# EAGLE design ir-splitter (EAGLE 6.3)
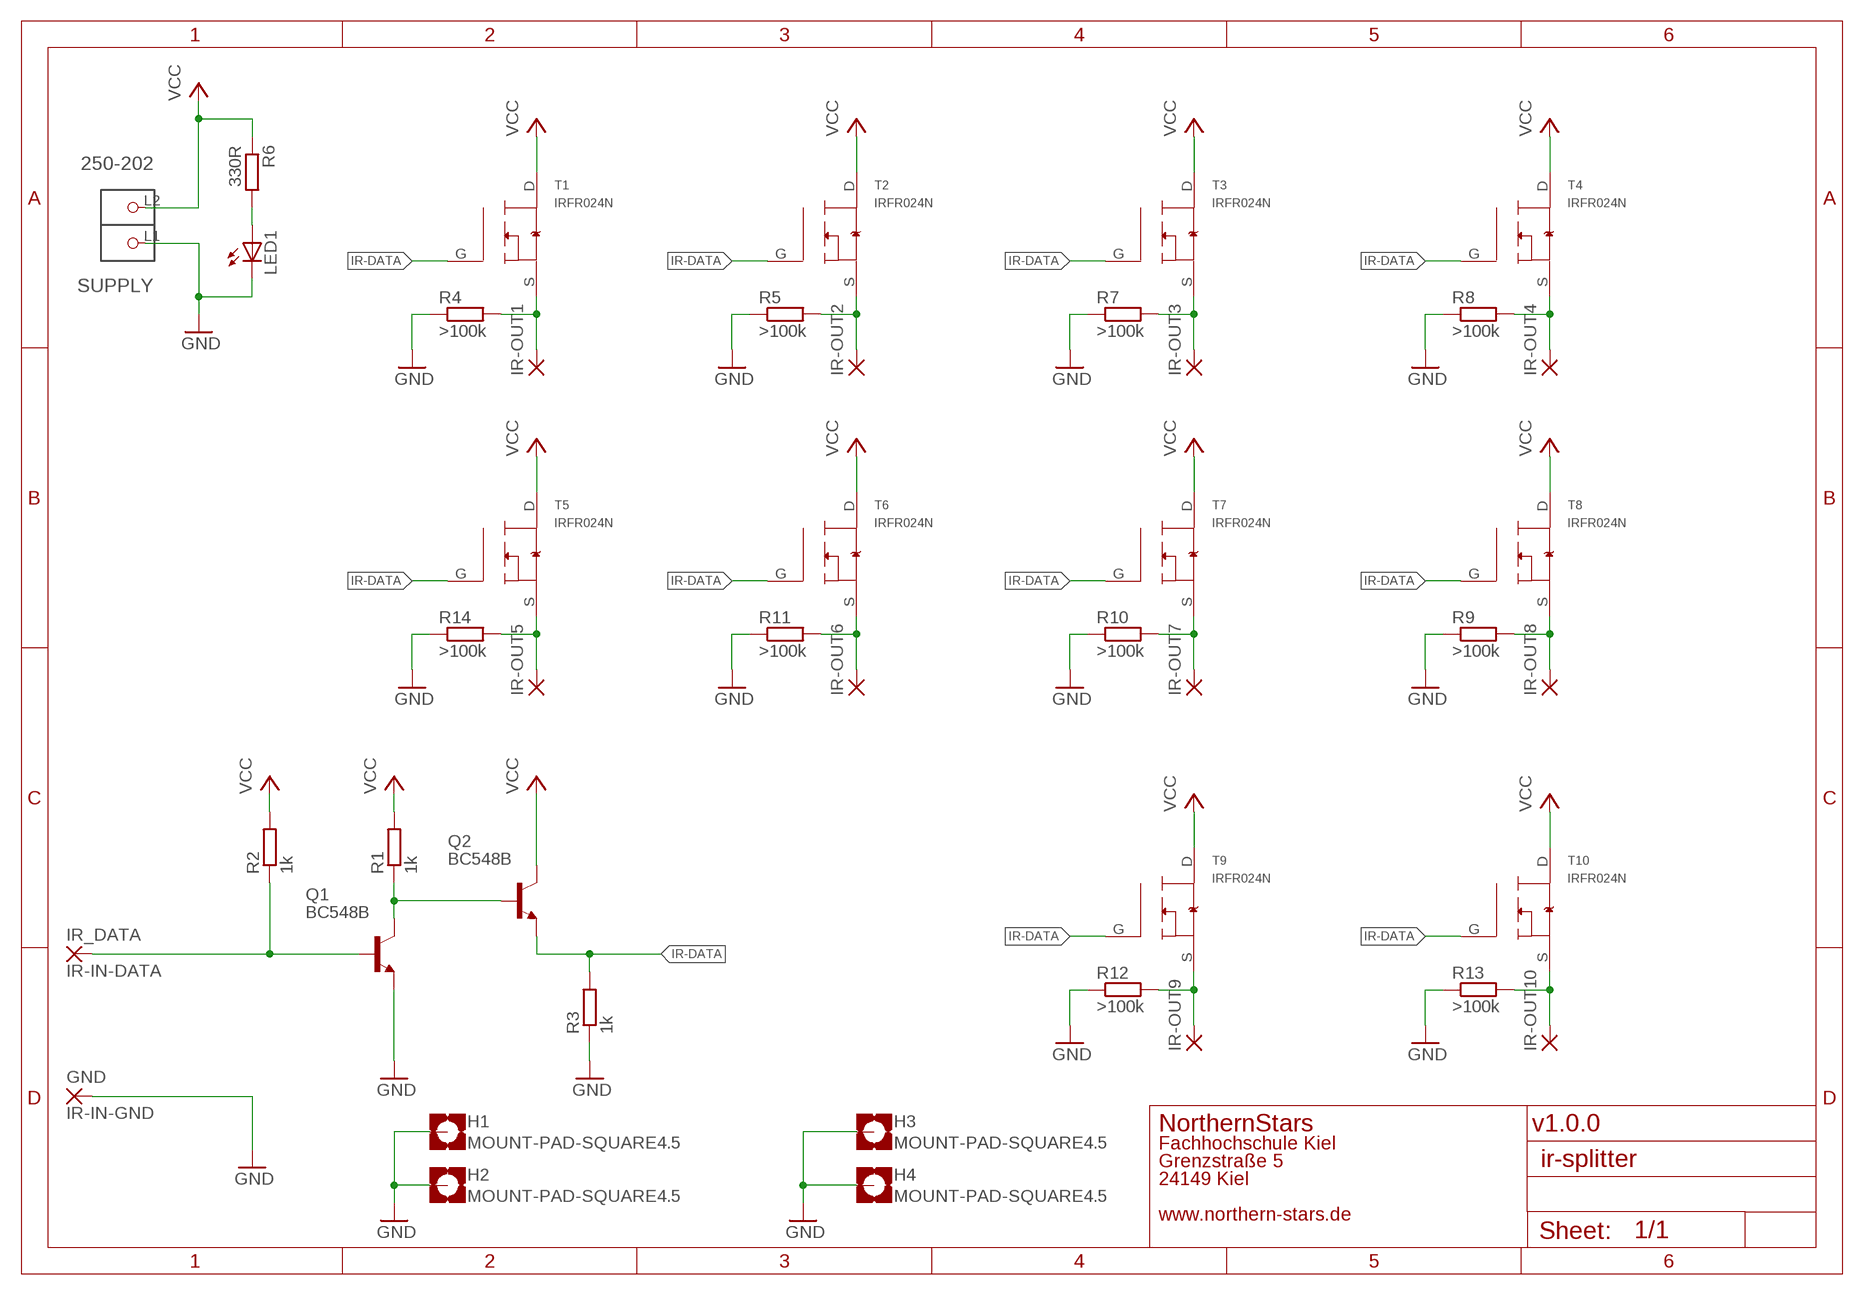
[diagram p0: schematic, sheet 1]

## Parts
GND  IR-IN-GND  3,81/1,4  [3,81/1,4]
H1  MOUNT-PAD-SQUARE4.5  [4,5-PAD-SQUARE]
H2  MOUNT-PAD-SQUARE4.5  [4,5-PAD-SQUARE]
H3  MOUNT-PAD-SQUARE4.5  [4,5-PAD-SQUARE]
H4  MOUNT-PAD-SQUARE4.5  [4,5-PAD-SQUARE]
IR-OUT1  3,81/1,4  [3,81/1,4]
IR-OUT2  3,81/1,4  [3,81/1,4]
IR-OUT3  3,81/1,4  [3,81/1,4]
IR-OUT4  3,81/1,4  [3,81/1,4]
IR-OUT5  3,81/1,4  [3,81/1,4]
IR-OUT6  3,81/1,4  [3,81/1,4]
IR-OUT7  3,81/1,4  [3,81/1,4]
IR-OUT8  3,81/1,4  [3,81/1,4]
IR-OUT9  3,81/1,4  [3,81/1,4]
IR-OUT10  3,81/1,4  [3,81/1,4]
IR_DATA  IR-IN-DATA  3,81/1,4  [3,81/1,4]
LED1  LEDCHIPLED_1206  [CHIPLED_1206]
Q1  BC548B  [TO92-EBC]
Q2  BC548B  [TO92-EBC]
R1  1k  R-EU_R1206  [R1206]
R2  1k  R-EU_R1206  [R1206]
R3  1k  R-EU_R1206  [R1206]
R4  >100k  R-EU_R1206  [R1206]
R5  >100k  R-EU_R1206  [R1206]
R6  330R  R-EU_R1206  [R1206]
R7  >100k  R-EU_R1206  [R1206]
R8  >100k  R-EU_R1206  [R1206]
R9  >100k  R-EU_R1206  [R1206]
R10  >100k  R-EU_R1206  [R1206]
R11  >100k  R-EU_R1206  [R1206]
R12  >100k  R-EU_R1206  [R1206]
R13  >100k  R-EU_R1206  [R1206]
R14  >100k  R-EU_R1206  [R1206]
SUPPLY  250-202  [P-250-202]
T1  IRFR024N  IRLR3915PBF  [D-PAK]
T2  IRFR024N  IRLR3915PBF  [D-PAK]
T3  IRFR024N  IRLR3915PBF  [D-PAK]
T4  IRFR024N  IRLR3915PBF  [D-PAK]
T5  IRFR024N  IRLR3915PBF  [D-PAK]
T6  IRFR024N  IRLR3915PBF  [D-PAK]
T7  IRFR024N  IRLR3915PBF  [D-PAK]
T8  IRFR024N  IRLR3915PBF  [D-PAK]
T9  IRFR024N  IRLR3915PBF  [D-PAK]
T10  IRFR024N  IRLR3915PBF  [D-PAK]

## Nets
GND: GND.1(P) H1.B4,5(MOUNT) H2.B4,5(MOUNT) H3.B4,5(MOUNT) H4.B4,5(MOUNT) LED1.C Q1.E R3.1 R4.1 R5.1 R7.1 R8.1 R9.1 R10.1 R11.1 R12.1 R13.1 R14.1 SUPPLY.L1(P1)
IR-DATA: Q2.E R3.2 T1.G T2.G T3.G T4.G T5.G T6.G T7.G T8.G T9.G T10.G
N$1: IR-OUT1.1(P) R4.2 T1.S
N$2: IR-OUT2.1(P) R5.2 T2.S
N$3: IR-OUT5.1(P) R14.2 T5.S
N$4: IR-OUT6.1(P) R11.2 T6.S
N$5: IR-OUT8.1(P) R9.2 T8.S
N$6: IR-OUT7.1(P) R10.2 T7.S
N$7: IR-OUT4.1(P) R8.2 T4.S
N$8: IR-OUT3.1(P) R7.2 T3.S
N$9: IR-OUT10.1(P) R13.2 T10.S
N$10: IR-OUT9.1(P) R12.2 T9.S
N$11: Q1.C Q2.B R1.1
N$15: LED1.A R6.2
N$16: IR_DATA.1(P) Q1.B R2.1
VCC: Q2.C R1.2 R2.2 R6.1 SUPPLY.L2(P2) T1.D T2.D T3.D T4.D T5.D T6.D T7.D T8.D T9.D T10.D

## Notes on the sheet
- NorthernStars | v1.0.0
- Fachhochschule Kiel
- Grenzstraße 5
- 24149 Kiel
- www.northern-stars.de

## Library data of the parts
GND IR-OUT1-IR-OUT10 IR_DATA = wirepad:3,81/1,4: THROUGH-HOLE PAD
H1-H4 = holes:MOUNT-PAD-SQUARE: MOUNTING PAD, square
LED1 = led:LED: LED OSRAM: - CHIPLED LG R971, LG N971, LY N971, LG Q971, LY Q971, LO R971, LY R971 LH N974, LH R974 LS Q976, LO Q976, LY Q976 LO Q996 - Hyper CHIPLED LW Q18S LB Q993, LB Q99A, LB R99A - SideLED LS A670, LO A670, LY A670, LG A670, LP A670 LB A673, LV A673, LT A673, LW A673 LH A674 LY A675 LS A676, LA A676, LO A676, LY A676, LW A676 LS A679, LY A679, LG A679 - Hyper Micro SIDELED® LS Y876, LA Y876, LO Y876, LY Y876 LT Y87S - SmartLED LW L88C, LW L88S LB L89C, LB L89S, LG L890 LS L89K, LO L89K, LY L89K LS L896, LA L896, LO L896, LY L896 - TOPLED LS T670, LO T670, LY T670, LG T670, LP T670 LSG T670, LSP T670, LSY T670, LOP T670, LYG T670 LG T671, LOG T671, LSG T671 LB T673, LV T673, LT T673, LW T673 LH T674 LS T676, LA T676, LO T676, LY T676, LB T676, LH T676, LSB T676, LW T676 LB T67C, LV T67C, LT T67C, LS T67K, LO T67K, LY T67K, LW E67C LS E67B, LA E67B, LO E67B, LY E67B, LB E67C, LV E67C, LT E67C LW T67C LS T679, LY T679, LG T679 LS T770, LO T770, LY T770, LG T770, LP T770 LB T773, LV T773, LT T773, LW T773 LH T774 LS E675, LA E675, LY E675, LS T675 LS T776, LA T776, LO T776, LY T776, LB T776 LHGB T686 LT T68C, LB T68C - Hyper Mini TOPLED® LB M676 - Mini TOPLED Santana® LG M470 LS M47K, LO M47K, LY M47K Source: http://www.osram.convergy.de LUXEON: - LUMILED® LXK2-PW12-R00, LXK2-PW12-S00, LXK2-PW14-U00, LXK2-PW14-V00 LXK2-PM12-R00, LXK2-PM12-S00, LXK2-PM14-U00 LXK2-PE12-Q00, LXK2-PE12-R00, LXK2-PE12-S00, LXK2-PE14-T00, LXK2-PE14-U00 LXK2-PB12-K00, LXK2-PB12-L00, LXK2-PB12-M00, LXK2-PB14-N00, LXK2-PB14-P00, LXK2-PB14-Q00 LXK2-PR12-L00, LXK2-PR12-M00, LXK2-PR14-Q00, LXK2-PR14-R00 LXK2-PD12-Q00, LXK2-PD12-R00, LXK2-PD12-S00 LXK2-PH12-R00, LXK2-PH12-S00 LXK2-PL12-P00, LXK2-PL12-Q00, LXK2-PL12-R00 Source: www.luxeon.com KINGBRIGHT: KA-3528ASYC Source: www.kingbright.com
Q1 Q2 = transistor-npn:BC548*: NPN Transistor
R1-R14 = rcl:R-EU_: RESISTOR, European symbol
SUPPLY = con-wago_250:250-202: Serie 250, 1-Leiter-Klemmenleiste für Leiterplatten 1 Lötstift/Pol versetzt / Series 250, 1-conductor PCB terminal strip 1 solder pin/pole, staggered Polzahl / Pole No.: 2 Rastermaß / Pitch: 3.5 mm Bemessungsspannung / Rated Voltage: 320 V Nennstrom / Nominal Current: 8 A Leiterquerschnitt / Conductor Size: 0.2 - 1.5 mm² Anschlusstechnik / Connection Technology: Steckklemm-Anschluss Lötstiftlänge: / Solder Pin Length: 3.6 mm Leitereinführung (zur Platine) / Conductor entry angle (to PCB): 45 ° Farbe / Color: grau / gray Stand: 01.01.2012. Die jeweils aktuellen Daten zu diesem Artikel finden Sie in unserem Produktkatalog, den Sie unter www.wago.com einsehen können. As of: 01/01/2012. Please find the newest data for this article in our product catalogue, which can be viewed under www.wago.com.
T1-T10 = international:IRLR3915PBF

## Board
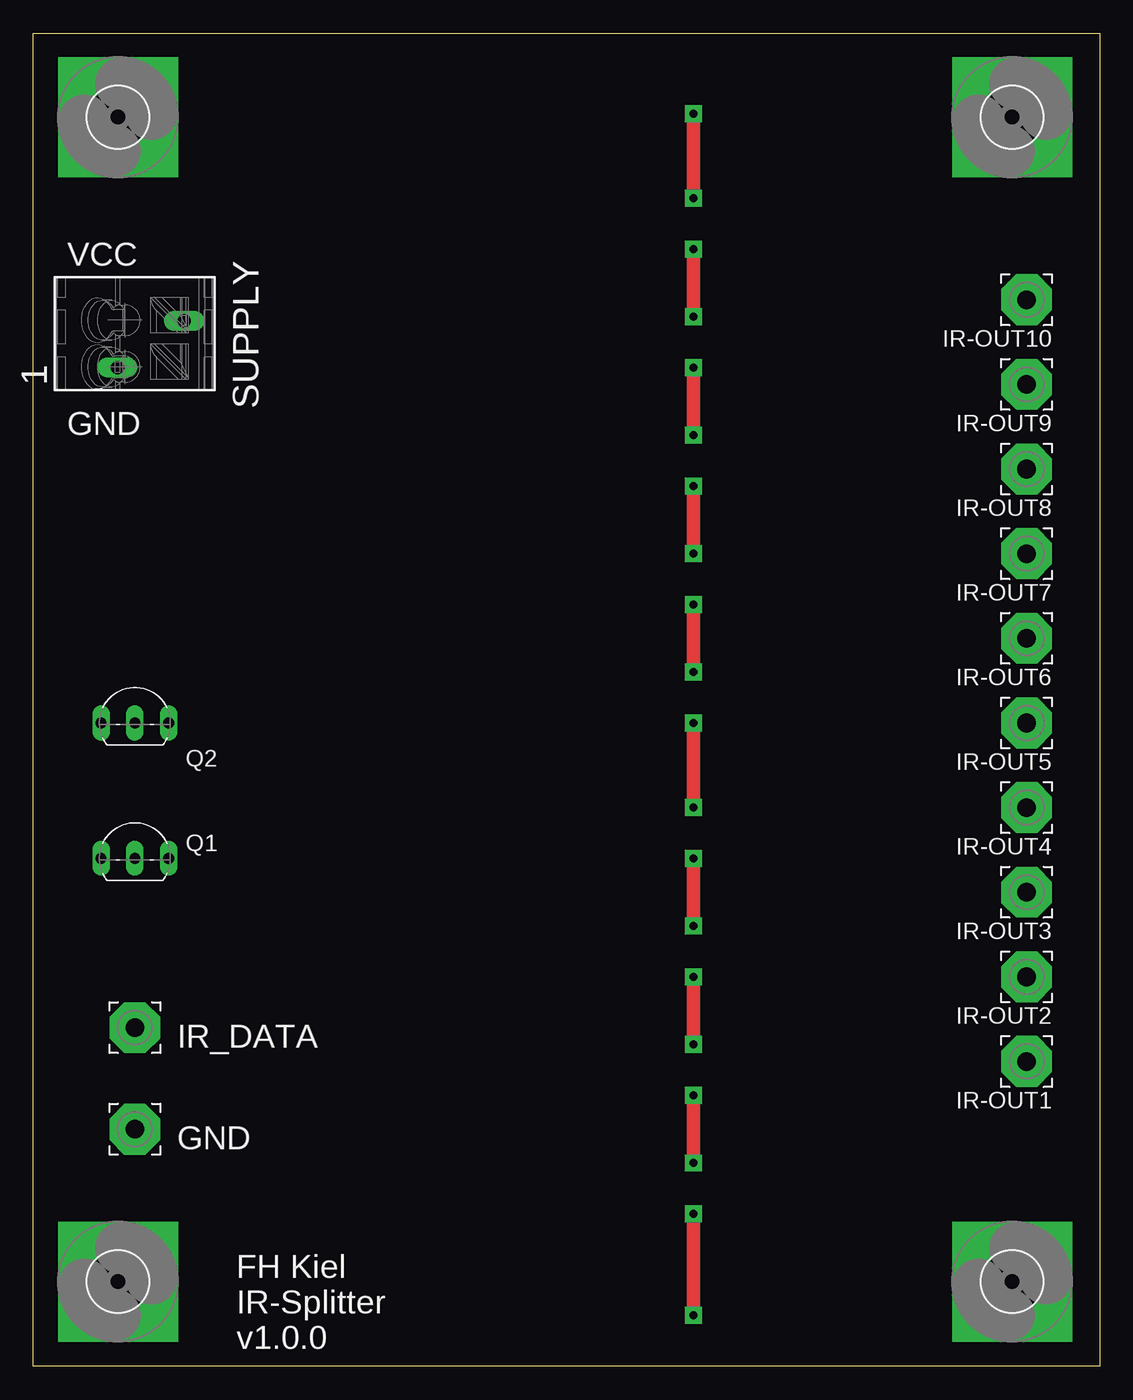
[diagram p1: board, top side]
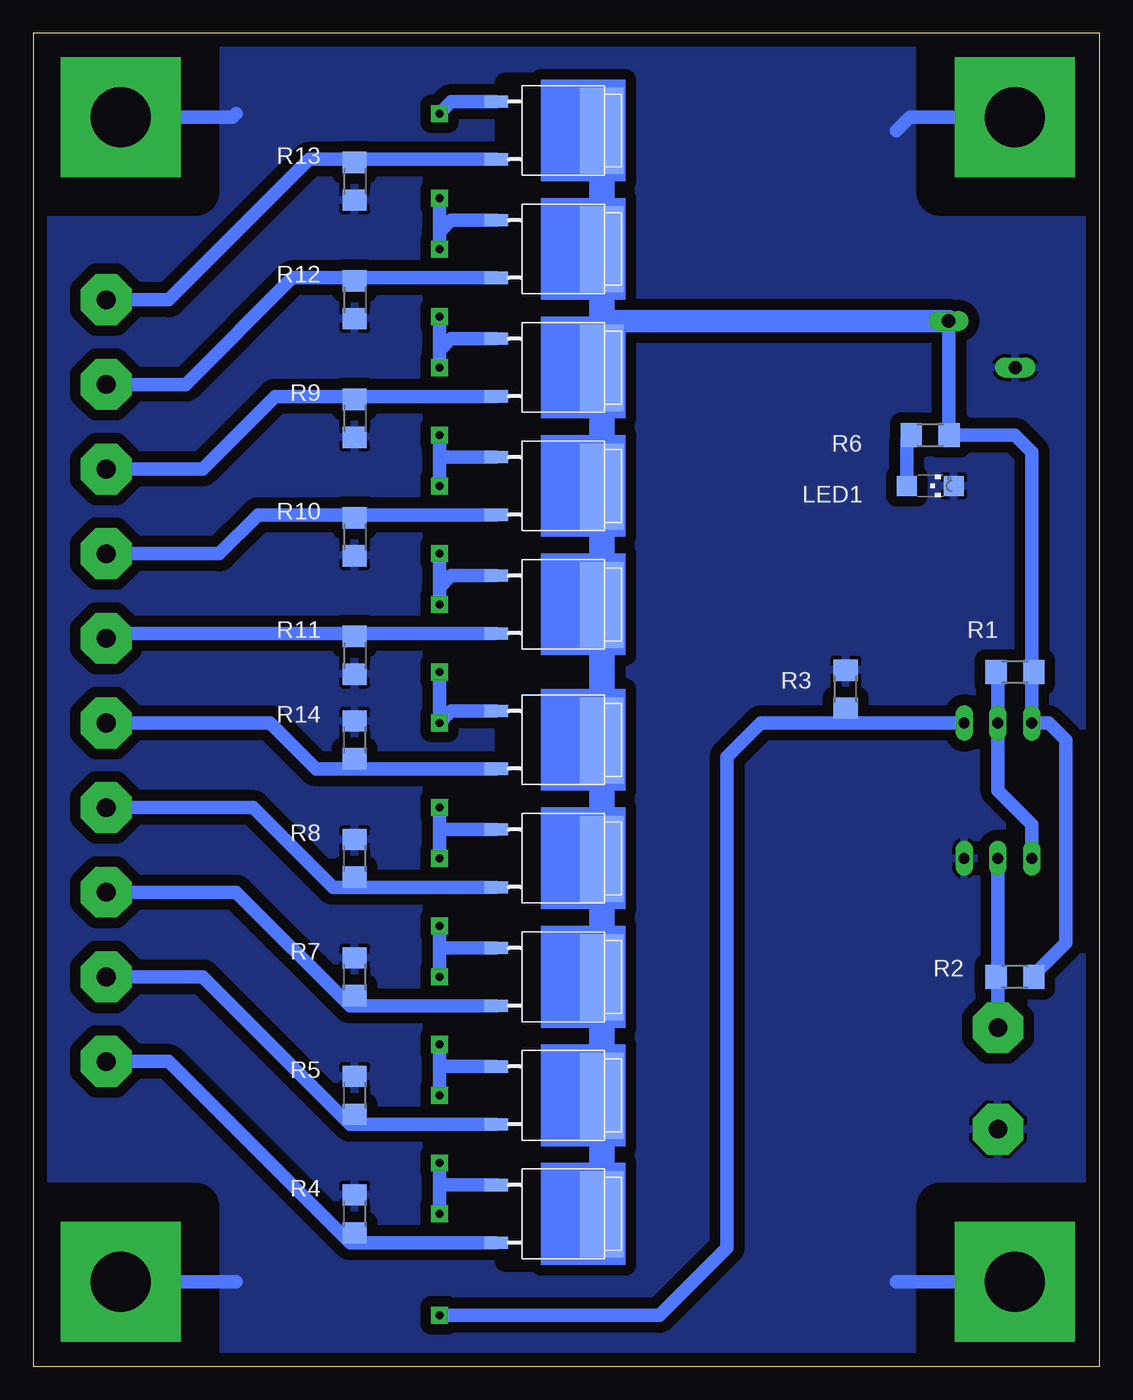
[diagram p2: board, bottom side, seen from below]

Size 80 x 100 mm. Coordinates in mm from the lower left corner, seen from the top.
Outline: 0,0 0,100 80,100 80,0 0,0
Copper layers (1*16): Top 0.035mm / dielectric 1.5mm / Bottom 0.035mm
Design rules "default": minimum track width 10mil, minimum drill 24mil, track to track 8mil, track to pad 8mil, pad to pad 8mil, via to via 8mil, smd to smd 8mil, copper to edge 40mil, drill to drill 8mil, minimum pad ring 10mil, minimum via ring 8mil, stop-mask expansion 4mil, vias tented up to drill 0mil, thermal gap 10mil

### Footprints (pad centres in the part's own frame; a part is rotated, then mirrored left to right if it is on the bottom)
3,81/1,4 = drill 1.397 pad 3.81 octagon: 1 0,0
4,5-PAD-SQUARE = drill 4.5 pad 9 square: B4,5 0,0
CHIPLED_1206 = smd 1.5 x 1.5: A 0,-1.75; C 0,1.75
TO92-EBC = drill 0.813 long: B 0,-1.27; C -2.54,-1.27; E 2.54,-1.27
R1206 = smd 1.6 x 1.803: 1 -1.422,0; 2 1.422,0
P-250-202 = drill 1 long: L1 1.3,2.55; L2 -3.7,-0.95
D-PAK = smd 6.452 x 3.251: D 0.03,2.89 | smd 0.914 x 1.778: G -2.16,-5.03; S 2.17,-5.03

### Placement (x,y rotation side)
GND  7.62,17.78 0 top
H1  6.35,6.35 0 top
H2  6.35,93.71 0 top
H3  73.44,93.71 0 top
H4  73.44,6.35 0 top
IR-OUT1  74.53,22.86 180 top
IR-OUT2  74.53,29.21 180 top
IR-OUT3  74.53,35.56 180 top
IR-OUT4  74.53,41.91 180 top
IR-OUT5  74.53,48.26 180 top
IR-OUT6  74.53,54.61 180 top
IR-OUT7  74.53,60.96 180 top
IR-OUT8  74.53,67.31 180 top
IR-OUT9  74.53,73.66 180 top
IR-OUT10  74.53,80.01 180 top
IR_DATA  7.62,25.4 0 top
LED1  12.7,66.04 270 bottom
Q1  7.62,39.37 0 top
Q2  7.62,49.53 0 top
R1  6.35,52.07 0 bottom
R2  6.35,29.21 0 bottom
R3  19.05,50.8 270 bottom
R4  55.88,11.43 270 bottom
R5  55.88,20.32 270 bottom
R6  12.7,69.85 180 bottom
R7  55.88,29.21 270 bottom
R8  55.88,38.1 270 bottom
R9  55.88,71.12 90 bottom
R10  55.88,62.23 90 bottom
R11  55.88,53.34 90 bottom
R12  55.88,80.01 90 bottom
R13  55.88,88.9 90 bottom
R14  55.88,46.99 270 bottom
SUPPLY  7.62,77.47 180 top
T1  40.24,11.43 270 bottom
T2  40.24,20.32 270 bottom
T3  40.24,29.21 270 bottom
T4  40.24,38.1 270 bottom
T5  40.24,46.99 270 bottom
T6  40.24,57.15 270 bottom
T7  40.24,66.04 270 bottom
T8  40.24,74.93 270 bottom
T9  40.24,83.82 270 bottom
T10  40.24,92.71 270 bottom

### Tracks (layer width: path | path; a pad name or v marks a point on that pad's centre or on a via)
GND
  Bottom 1.016: H4.B4,5 64.77,6.35 | H3.B4,5 65.04,93.71 64.77,93.98 | H2.B4,5 14.24,93.71 15.24,92.71 | H1.B4,5 15.24,6.35
  pour Bottom (isolate 0.813): 0,0 0,100.33 80.01,100.33 80.01,0
IR-DATA  (via drill 0.6 pad 1.27)
  Top 1.016: v49.53,93.98 v49.53,87.63 | v49.53,83.82 v49.53,78.74 | v49.53,74.93 v49.53,69.85 | v49.53,66.04 v49.53,60.96 | v49.53,57.15 v49.53,52.07 | v49.53,15.24 v49.53,20.32 | v49.53,24.13 v49.53,29.21 | v49.53,33.02 v49.53,38.1 | v49.53,41.91 v49.53,48.26 | v49.53,3.81 v49.53,11.43
  Bottom 1.016: T10.G 48.64,94.87 v49.53,93.98 | v49.53,87.63 49.53,85.09 | 49.53,85.09 v49.53,83.82 | v49.53,78.74 49.53,76.2 | 49.53,76.2 v49.53,74.93 | v49.53,69.85 49.53,68.58 | 49.53,68.58 v49.53,66.04 | v49.53,60.96 49.53,58.42 | 49.53,58.42 v49.53,57.15 | v49.53,52.07 v49.53,48.26 48.64,49.15 T5.G | T1.G 49.15,13.59 49.53,13.97 | v49.53,20.32 49.53,22.86 | 49.53,22.86 v49.53,24.13 | v49.53,29.21 49.53,31.75 | 49.53,31.75 v49.53,33.02 | v49.53,38.1 49.53,40.64 | 49.53,40.64 v49.53,41.91 | T6.G 48.64,59.31 49.53,58.42 | T7.G 49.15,68.2 49.53,68.58 | T8.G 48.64,77.09 49.53,76.2 | T9.G 48.64,85.98 49.53,85.09 | T3.G 49.15,31.37 49.53,31.75 | T2.G 49.15,22.48 49.53,22.86 | T4.G 49.15,40.26 49.53,40.64 | v49.53,3.81 33.02,3.81 27.94,8.89 27.94,45.72 25.4,48.26 19.05,48.26 | v49.53,11.43 49.53,13.97 | 49.53,13.97 v49.53,15.24 | Q2.E 19.05,48.26 | R3.2 19.05,48.26
N$1
  Bottom 1.016: T1.S 55.88,9.26 | 55.88,9.26 56.25,9.26 69.85,22.86 IR-OUT1.1 | R4.2 55.88,9.26
N$2
  Bottom 1.016: T2.S 55.88,18.15 | 55.88,18.15 56.25,18.15 67.31,29.21 IR-OUT2.1 | R5.2 55.88,18.15
N$3
  Bottom 1.016: T5.S 55.88,44.82 | 55.88,44.82 58.79,44.82 62.23,48.26 IR-OUT5.1 | R14.2 55.88,44.82
N$4
  Bottom 1.016: T6.S 55.88,54.98 | 55.88,54.98 74.16,54.98 IR-OUT6.1 | R11.2 55.88,54.98
N$5
  Bottom 1.016: T8.S 55.88,72.76 | 55.88,72.76 61.86,72.76 67.31,67.31 IR-OUT8.1 | 55.88,72.39 R9.2 55.88,72.76
N$6
  Bottom 1.016: T7.S 55.88,63.87 | 55.88,63.87 63.13,63.87 66.04,60.96 IR-OUT7.1 | R10.2 55.88,63.87
N$7
  Bottom 1.016: T4.S 55.88,35.93 | 55.88,35.93 57.52,35.93 63.5,41.91 IR-OUT4.1 | R8.2 55.88,35.93
N$8
  Bottom 1.016: T3.S 55.88,27.04 | 55.88,27.04 56.25,27.04 64.77,35.56 IR-OUT3.1 | R7.2 55.88,27.04
N$9
  Bottom 1.016: T10.S 55.88,90.54 | 55.88,90.54 59.32,90.54 69.85,80.01 IR-OUT10.1 | R13.2 55.88,90.54
N$10
  Bottom 1.016: T9.S 55.88,81.65 | 55.88,81.65 60.59,81.65 68.58,73.66 IR-OUT9.1 | R12.2 55.88,81.65
N$11
  Bottom 1.016: Q1.C 5.08,40.64 7.62,43.18 Q2.B 7.62,51.92 R1.1
N$15
  Bottom 1.016: LED1.A 14.45,69.52 R6.2
N$16
  Bottom 1.016: IR_DATA.1 7.62,29.06 R2.1 7.62,29.36 Q1.B
VCC
  Bottom 1.016: SUPPLY.L2 11.32,69.89 R6.1 6.35,69.85 5.08,68.58 5.08,52.22 R1.2 5.08,51.92 Q2.C 3.81,48.26 2.54,46.99 2.54,31.75 4.93,29.36 R2.2
  Bottom 1.676: SUPPLY.L2 37.03,78.42 37.35,78.74
  Bottom 1.93: T1.D T2.D T3.D T4.D T5.D T6.D T7.D T8.D 37.35,78.74 T9.D T10.D
(copper drawn outside any net)
  shapes: Bottom area x10

### Text on the board
tNames: VCC | GND | FH Kiel / IR-Splitter / v1.0.0